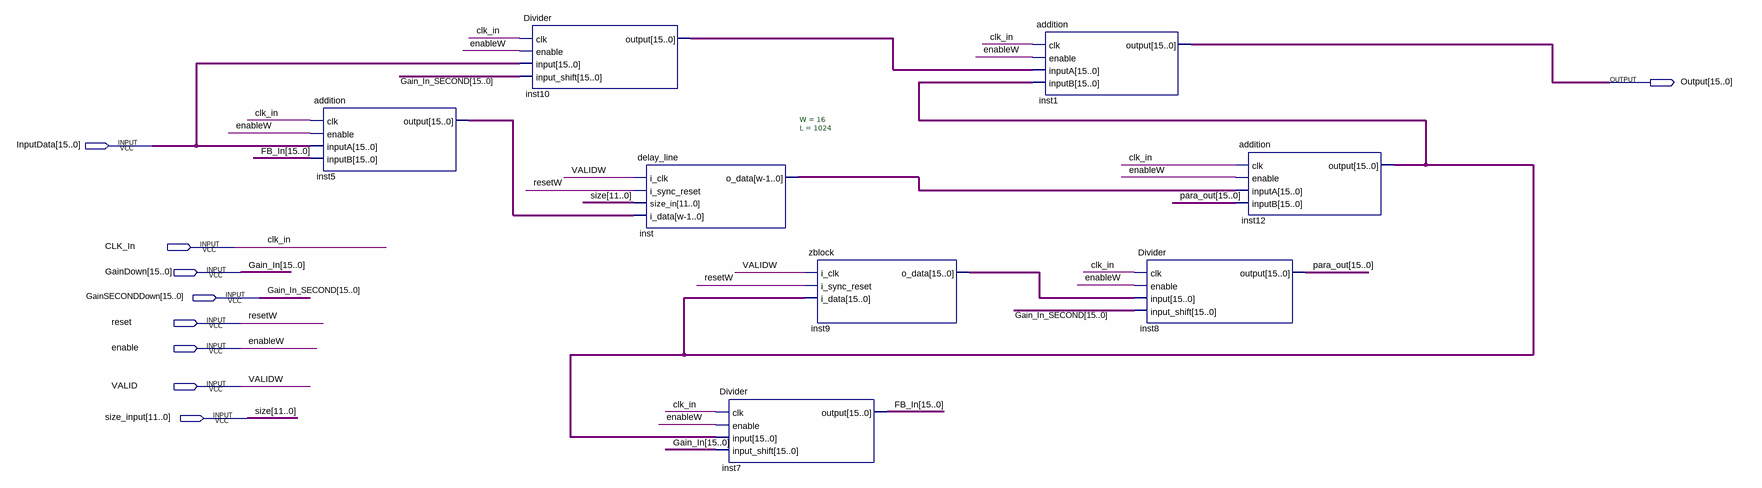
[diagram p0: schematic sheet]
// Quartus schematic LowPassEchotest.bdf as structural Verilog: 8 symbols, 9 pins
module LowPassEchotest (
  input  [15:0] InputData,
  input  CLK_In,
  input  [15:0] GainDown,
  input  [15:0] GainSECONDDown,
  input  reset,
  input  enable,
  input  VALID,
  input  [11:0] size_input,
  output [15:0] Output
);

  wire [15:0] FB_In, inst5_output, inst9_o_data, inst10_output, inst12_output, inst_o_data, para_out;

  addition inst5 (.clk(CLK_In), .enable(enable), .inputA(InputData), .inputB(FB_In), .\output (inst5_output));
  Divider inst10 (
    .clk(CLK_In), .enable(enable), .\input (InputData), .input_shift(GainSECONDDown), .\output (inst10_output));
  delay_line #(.W(16), .L(1024)) inst (
    .i_clk(VALID), .i_sync_reset(reset), .size_in(size_input), .i_data(inst5_output), .o_data(inst_o_data));
  Divider inst7 (.clk(CLK_In), .enable(enable), .\input (inst12_output), .input_shift(GainDown), .\output (FB_In));
  zblock inst9 (.i_clk(VALID), .i_sync_reset(reset), .i_data(inst12_output), .o_data(inst9_o_data));
  addition inst1 (.clk(CLK_In), .enable(enable), .inputA(inst10_output), .inputB(inst12_output), .\output (Output));
  Divider inst8 (
    .clk(CLK_In), .enable(enable), .\input (inst9_o_data), .input_shift(GainSECONDDown), .\output (para_out));
  addition inst12 (.clk(CLK_In), .enable(enable), .inputA(inst_o_data), .inputB(para_out), .\output (inst12_output));

  // Other names for the same wires on the sheet: enableW = enable; Gain_In[15:0] = GainDown;
  //   Gain_In_SECOND[15:0] = GainSECONDDown; resetW = reset; size[11:0] = size_input; VALIDW = VALID
endmodule
